# Altium schematic sheet mainboard.SchDoc: 光电一队
size A4; Author: 林震; Organization: 厦门大学嘉庚学院
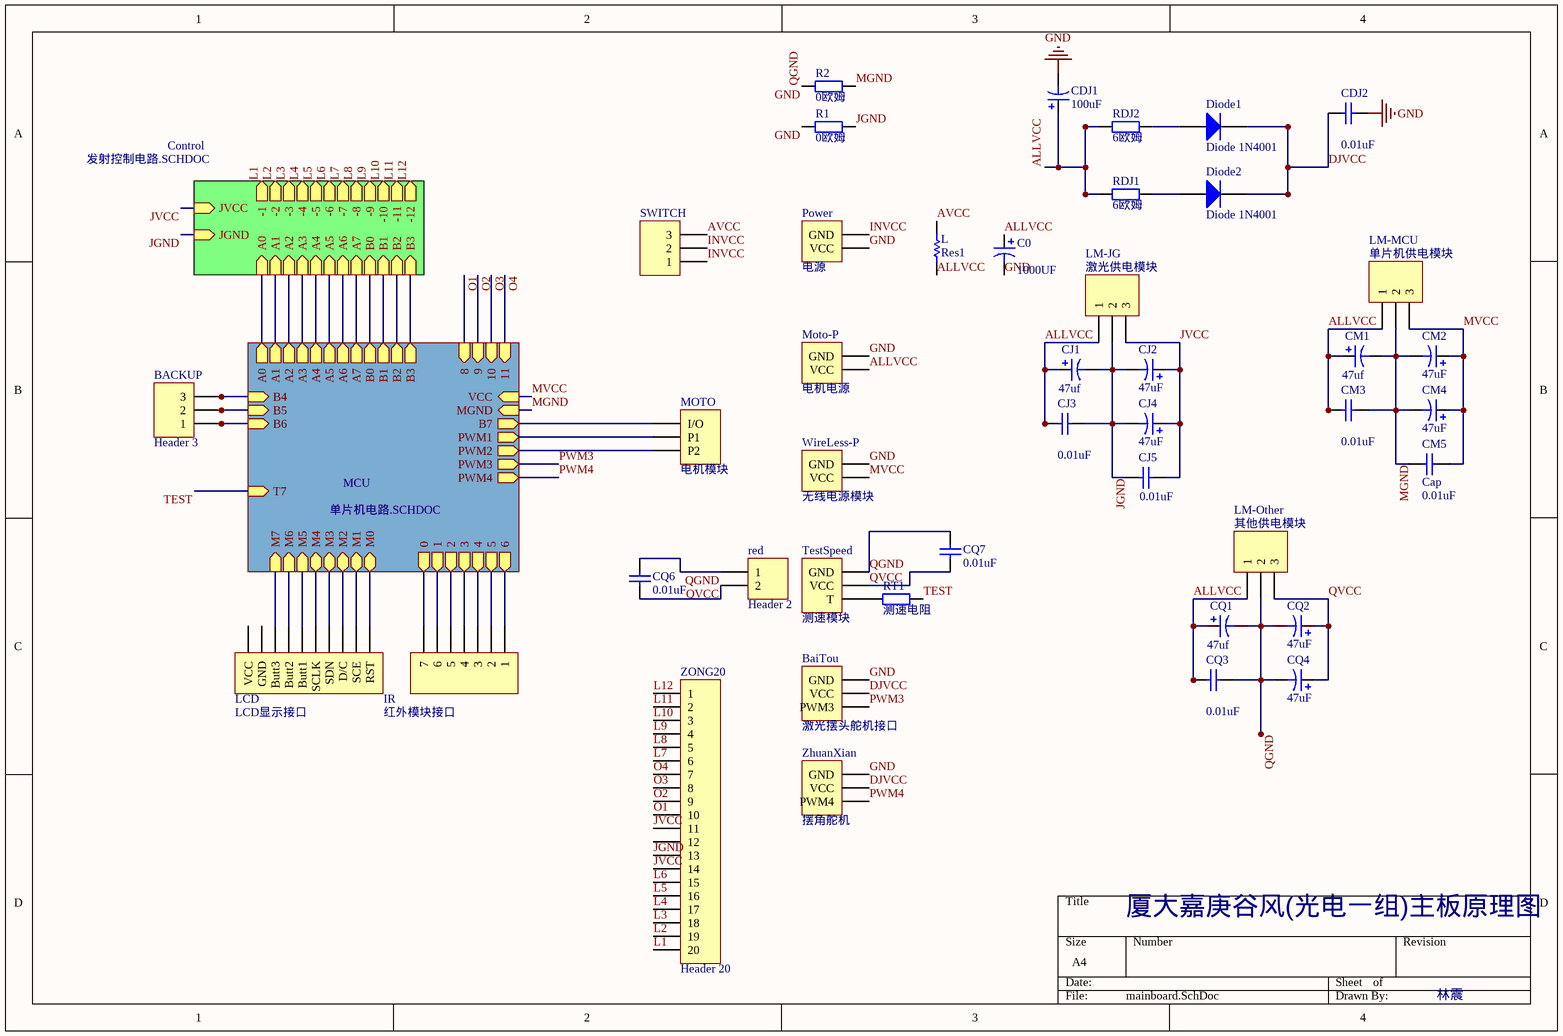
[diagram p0: mainboard.SchDoc]

## Parts
BACKUP  Header 3  [HDR1X3]
BaiTou  激光摆头舵机接口  [HDR1X3]
C0  value 1000UF  [1000UF]  (hidden comment: BATT)
CDJ1  100uF  [100UF]
CDJ2  value 0.01uF  [0805]  (hidden comment: Cap)
CJ1  value 47uf  [3528]  (hidden comment: Cap Pol3)
CJ2  47uF  [3528]
CJ3  value 0.01uF  [0805]  (hidden comment: Cap)
CJ4  47uF  [47UF]
CJ5  value 0.01uF  [0805]  (hidden comment: Cap)
CM1  value 47uf  [3528]  (hidden comment: Cap Pol3)
CM2  47uF  [3528]
CM3  value 0.01uF  [0805]  (hidden comment: Cap)
CM4  47uF  [47UF]
CM5  Cap  value 0.01uF  [0805]
CQ1  value 47uf  [3528]  (hidden comment: Cap Pol3)
CQ2  47uF  [3528]
CQ3  value 0.01uF  [0805]  (hidden comment: Cap)
CQ4  47uF  [47UF]
CQ6  value 0.01uF  [0805]  (hidden comment: Cap)
CQ7  value 0.01uF  [0805]  (hidden comment: Cap)
Diode1  Diode 1N4001  [DO-41]
Diode2  Diode 1N4001  [DO-41]
IR  红外模块接口  [HDR1X7]
L  Res1  [10UH]
LCD  LCD显示接口  [HDR1X10]
LM-JG  激光供电模块  [HDR1X3]
LM-MCU  单片机供电模块  [HDR1X3]
LM-Other  其他供电模块  [HDR1X3]
MOTO  电机模块  [HDR1X3]
Moto-P  电机电源  [tongzhu]
Power  电源  [tongzhu]
R1  0欧姆  [0805]
R2  0欧姆  [0805]
RDJ1  6欧姆  [0805]
RDJ2  6欧姆  [0805]
red  Header 2  [HDR1X2]
RT1  测速电阻  [0805]
SWITCH  SWITCH  [SWITCH]  (value not drawn)
TestSpeed  测速模块  [HDR1X3]
WireLess-P  无线电源模块  [HDR1X2]
ZhuanXian  摆角舵机  [HDR1X3]
ZONG20  Header 20  [ZONG20]

## Sub-sheets
Control = 发射控制电路.SCHDOC: A0 (in), A1 (in), A2 (in), A3 (in), JVCC (in), JGND (in), A4 (in), A5 (in), A6 (in), A7 (in), B0 (in), B1 (in), B3 (in), B2 (in), -1 (out), -2 (out), -3 (out), -4 (out), -5 (out), -6 (out), -7 (out), -8 (out), -9 (out), -10 (out), -11 (out), -12 (out)
MCU = 单片机电路.SCHDOC: PWM1 (out), PWM2 (out), PWM3 (out), PWM4 (out), A1 (out), A2 (out), A3 (out), A4 (out), 8 (in), 9 (in), 10 (in), A0 (out), 11 (in), 1 (out), 2 (out), 3 (out), 4 (out), 5 (out), 6 (out), VCC (in), MGND (in), M4, M7 (in), M3, M2, M1, M0, M5 (in), M6 (in), 0 (out), A5 (out), A6 (out), B7 (out), B4 (in), B6 (in), B5 (in), T7 (in), A7 (out), B0 (out), B1 (out), B2 (out), B3 (out)

## Nets
GND: BaiTou.3(GND) C0.2 CDJ1.2 CDJ2.1 CQ1.2 CQ2.2 CQ3.1 CQ4.2 CQ6.1 CQ7.1 LM-Other.2 Moto-P.2(GND) Power.1(VCC) R1.2 R2.2 red.1 TestSpeed.3(GND) WireLess-P.2(GND) ZhuanXian.3(GND)  [also labelled QGND]
ALLVCC: C0.1 CDJ1.1 CJ1.1 CJ3.2 CM1.1 CM3.2 CQ1.1 CQ3.2 L.1 LM-JG.1 LM-MCU.1 LM-Other.1 Moto-P.1(VCC) RDJ1.2 RDJ2.2
AVCC: L.2 SWITCH.3
DJVCC: BaiTou.2(VCC) CDJ2.2 Diode1.2(K) Diode2.2(K) ZhuanXian.2(VCC)
INVCC: Power.2(GND) SWITCH.1 SWITCH.2
JGND: CJ1.2 CJ2.2 CJ3.1 CJ4.2 CJ5.2 LM-JG.2 R1.1 ZONG20.13 ; sheet Control/JGND
JVCC: CJ2.1 CJ4.1 CJ5.1 LM-JG.3 ZONG20.11 ZONG20.14 ; sheet Control/JVCC
L1: ZONG20.20 ; sheet Control/-1
L2: ZONG20.19 ; sheet Control/-2
L3: ZONG20.18 ; sheet Control/-3
L4: ZONG20.17 ; sheet Control/-4
L5: ZONG20.16 ; sheet Control/-5
L6: ZONG20.15 ; sheet Control/-6
L7: ZONG20.6 ; sheet Control/-7
L8: ZONG20.5 ; sheet Control/-8
L9: ZONG20.4 ; sheet Control/-9
L10: ZONG20.3 ; sheet Control/-10
L11: ZONG20.2 ; sheet Control/-11
L12: ZONG20.1 ; sheet Control/-12
MGND: CM1.2 CM2.2 CM3.1 CM4.2 CM5.2 LM-MCU.2 R2.1 ; sheet MCU/MGND
MVCC: CM2.1 CM4.1 CM5.1 LM-MCU.3 WireLess-P.1(VCC) ; sheet MCU/VCC
O1: ZONG20.10 ; sheet MCU/8
O2: ZONG20.9 ; sheet MCU/9
O3: ZONG20.8 ; sheet MCU/10
O4: ZONG20.7 ; sheet MCU/11
PWM3: BaiTou.1(PWM3) ; sheet MCU/PWM3
PWM4: ZhuanXian.1(PWM4) ; sheet MCU/PWM4
QVCC: CQ2.1 CQ4.1 CQ6.2 CQ7.2 LM-Other.3 red.2 TestSpeed.2(VCC)
TEST: RT1.2 ; sheet MCU/T7
NetBACKUP_1: BACKUP.1 ; sheet MCU/B6
NetBACKUP_2: BACKUP.2 ; sheet MCU/B5
NetBACKUP_3: BACKUP.3 ; sheet MCU/B4
NetDiode1_1: Diode1.1(A) RDJ2.1
NetDiode2_1: Diode2.1(A) RDJ1.1
NetIR_1: IR.1 ; sheet MCU/6
NetIR_2: IR.2 ; sheet MCU/5
NetIR_3: IR.3 ; sheet MCU/4
NetIR_4: IR.4 ; sheet MCU/3
NetIR_5: IR.5 ; sheet MCU/2
NetIR_6: IR.6 ; sheet MCU/1
NetIR_7: IR.7 ; sheet MCU/0
NetLCD_1: LCD.1(RST) ; sheet MCU/M0
NetLCD_2: LCD.2(SCE) ; sheet MCU/M1
NetLCD_3: LCD.3(D/C) ; sheet MCU/M2
NetLCD_4: LCD.4(SDN) ; sheet MCU/M3
NetLCD_5: LCD.5(SCLK) ; sheet MCU/M4
NetLCD_6: LCD.6(Butt1) ; sheet MCU/M5
NetLCD_7: LCD.7(Butt2) ; sheet MCU/M6
NetLCD_8: LCD.8(Butt3) ; sheet MCU/M7
NetMOTO_1: MOTO.1(I/O) ; sheet MCU/B7
NetMOTO_2: MOTO.2(P1) ; sheet MCU/PWM1
NetMOTO_3: MOTO.3(P2) ; sheet MCU/PWM2
NetRT1_1: RT1.1 TestSpeed.1(T)
(unnamed): sheet Control/A0, sheet MCU/A0
(unnamed): sheet Control/A1, sheet MCU/A1
(unnamed): sheet Control/A2, sheet MCU/A2
(unnamed): sheet Control/A3, sheet MCU/A3
(unnamed): sheet Control/A4, sheet MCU/A4
(unnamed): sheet Control/A5, sheet MCU/A5
(unnamed): sheet Control/A6, sheet MCU/A6
(unnamed): sheet Control/A7, sheet MCU/A7
(unnamed): sheet Control/B0, sheet MCU/B0
(unnamed): sheet Control/B1, sheet MCU/B1
(unnamed): sheet Control/B3, sheet MCU/B3
(unnamed): sheet Control/B2, sheet MCU/B2

Not connected (* = marked no-connect by the designer): LCD 9(GND) 10(VCC); ZONG20 12

## Notes on the sheet
- 厦大嘉庚谷风(光电一组)主板原理图
- 林震

## Library data of the parts
BACKUP = Header 3: 备用; LatestRevisionDate: 17-Jul-2002; LatestRevisionNote: Re-released for DXP Platform.; Publisher: Altium Limited
BaiTou LM-JG LM-MCU LM-Other MOTO SWITCH TestSpeed ZhuanXian = Header 3: Header, 3-Pin; LatestRevisionDate: 17-Jul-2002; LatestRevisionNote: Re-released for DXP Platform.; Publisher: Altium Limited
C0 CJ1 CM1 CQ1 = Cap Pol3: Polarized Capacitor (Surface Mount); Published: 8-Jun-2000; LatestRevisionDate: 17-Jul-2002; LatestRevisionNote: Re-released for DXP Platform.; PackageReference: C0805; Publisher: Altium Limited
CDJ1 CJ2 CJ4 CM2 CM4 CQ2 CQ4 = Cap Pol1: Polarized Capacitor (Radial); Published: 8-Jun-2000; LatestRevisionDate: 17-Jul-2002; LatestRevisionNote: Re-released for DXP Platform.; Publisher: Altium Limited
CDJ2 CJ3 CJ5 CM3 CM5 CQ3 CQ6 CQ7 = Cap: Capacitor; Published: 8-Jun-2000; LatestRevisionDate: 17-Jul-2002; LatestRevisionNote: Re-released for DXP Platform.; PackageReference: RAD-0.3; Publisher: Altium Limited
Diode1 Diode2 = Diode 1N4001: 1 Amp General Purpose Rectifier; Published: 8-Jun-2000; LatestRevisionDate: 17-Jul-2002; LatestRevisionNote: Re-released for DXP Platform.; DatasheetDocument: 1998; PackageDocument: Aug-1999; PackageReference: DO-41; Publisher: Altium Limited; Code_JEDEC: DO-204-AL; ComponentLink1Description: Manufacturer Link; ComponentLink1URL: http://www.fairchildsemi.com/; ComponentLink2Description: Datasheet; ComponentLink2URL: http://www.fairchildsemi.com/ds/1N%2F1N4001.pdf
IR = Header 7: Header, 7-Pin; LatestRevisionDate: 17-Jul-2002; LatestRevisionNote: Re-released for DXP Platform.; Publisher: Altium Limited
L = Res1: Resistor; Value: 1K; Published: 8-Jun-2000; LatestRevisionDate: 17-Jul-2002; LatestRevisionNote: Re-released for DXP Platform.; PackageReference: AXIAL-0.3; Publisher: Altium Limited
LCD = Header 10: Header, 10-Pin; LatestRevisionDate: 17-Jul-2002; LatestRevisionNote: Re-released for DXP Platform.; Publisher: Altium Limited
Moto-P Power red WireLess-P = Header 2: Header, 2-Pin; LatestRevisionDate: 17-Jul-2002; LatestRevisionNote: Re-released for DXP Platform.; Publisher: Altium Limited
R1 R2 RDJ1 RDJ2 RT1 = Res2: Resistor; Published: 8-Jun-2000; LatestRevisionDate: 17-Jul-2002; LatestRevisionNote: Re-released for DXP Platform.; Publisher: Altium Limited
ZONG20 = Header 20: 传感下来引脚; LatestRevisionDate: 17-Jul-2002; LatestRevisionNote: Re-released for DXP Platform.; Publisher: Altium Limited